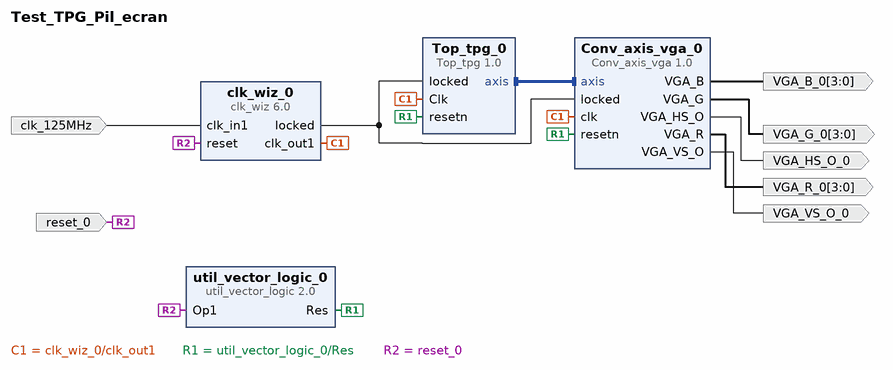
[diagram p0: block diagram of the top level]
# Vivado block design Test_TPG_Pil_ecran, xc7z010clg400-1, Vivado 2020.2
create_bd_design Test_TPG_Pil_ecran

create_bd_port -dir O -from 3 -to 0 VGA_R_0
create_bd_port -dir O -from 3 -to 0 VGA_G_0
create_bd_port -dir O -from 3 -to 0 VGA_B_0
create_bd_port -dir I -type rst reset_0
set_property -dict {CONFIG.POLARITY ACTIVE_HIGH} [get_bd_ports reset_0]
create_bd_port -dir I -type clk clk_125MHz
set_property -dict {CONFIG.FREQ_HZ 125000000} [get_bd_ports clk_125MHz]
create_bd_port -dir O VGA_VS_O_0
create_bd_port -dir O VGA_HS_O_0

create_bd_cell -type ip -vlnv xilinx.com:ip:clk_wiz:6.0 clk_wiz_0
set_property -dict [list \
  CONFIG.CLKIN1_JITTER_PS 80.0 \
  CONFIG.CLKOUT1_JITTER 312.659 \
  CONFIG.CLKOUT1_PHASE_ERROR 245.713 \
  CONFIG.CLKOUT1_REQUESTED_OUT_FREQ 25 \
  CONFIG.MMCM_CLKFBOUT_MULT_F 36.500 \
  CONFIG.MMCM_CLKIN1_PERIOD 8.000 \
  CONFIG.MMCM_CLKOUT0_DIVIDE_F 36.500 \
  CONFIG.MMCM_DIVCLK_DIVIDE 5 \
  CONFIG.PRIM_IN_FREQ 125 \
] [get_bd_cells clk_wiz_0]
create_bd_cell -type ip -vlnv xilinx.com:ip:util_vector_logic:2.0 util_vector_logic_0
set_property -dict {CONFIG.C_OPERATION not CONFIG.C_SIZE 1} [get_bd_cells util_vector_logic_0]
create_bd_cell -type ip -vlnv xilinx.com:user:Conv_axis_vga:1.0 Conv_axis_vga_0
create_bd_cell -type ip -vlnv xilinx.com:user:Top_tpg:1.0 Top_tpg_0

# ---- connections ----

connect_bd_intf_net [get_bd_intf_pins Top_tpg_0/axis] [get_bd_intf_pins Conv_axis_vga_0/axis]
connect_bd_net [get_bd_pins clk_wiz_0/clk_out1] [get_bd_pins Conv_axis_vga_0/clk] [get_bd_pins Top_tpg_0/Clk]
connect_bd_net [get_bd_pins util_vector_logic_0/Res] [get_bd_pins Conv_axis_vga_0/resetn] [get_bd_pins Top_tpg_0/resetn]
connect_bd_net -net reset_0_1 [get_bd_ports reset_0] [get_bd_pins clk_wiz_0/reset] [get_bd_pins util_vector_logic_0/Op1]
connect_bd_net [get_bd_pins clk_wiz_0/locked] [get_bd_pins Conv_axis_vga_0/locked] [get_bd_pins Top_tpg_0/locked]
connect_bd_net [get_bd_ports clk_125MHz] [get_bd_pins clk_wiz_0/clk_in1]
connect_bd_net [get_bd_pins Conv_axis_vga_0/VGA_R] [get_bd_ports VGA_R_0]
connect_bd_net [get_bd_pins Conv_axis_vga_0/VGA_G] [get_bd_ports VGA_G_0]
connect_bd_net [get_bd_pins Conv_axis_vga_0/VGA_B] [get_bd_ports VGA_B_0]
connect_bd_net [get_bd_pins Conv_axis_vga_0/VGA_VS_O] [get_bd_ports VGA_VS_O_0]
connect_bd_net [get_bd_pins Conv_axis_vga_0/VGA_HS_O] [get_bd_ports VGA_HS_O_0]

validate_bd_design
save_bd_design
